# Altium schematic sheet STM32L476_MCU.SchDoc
size A
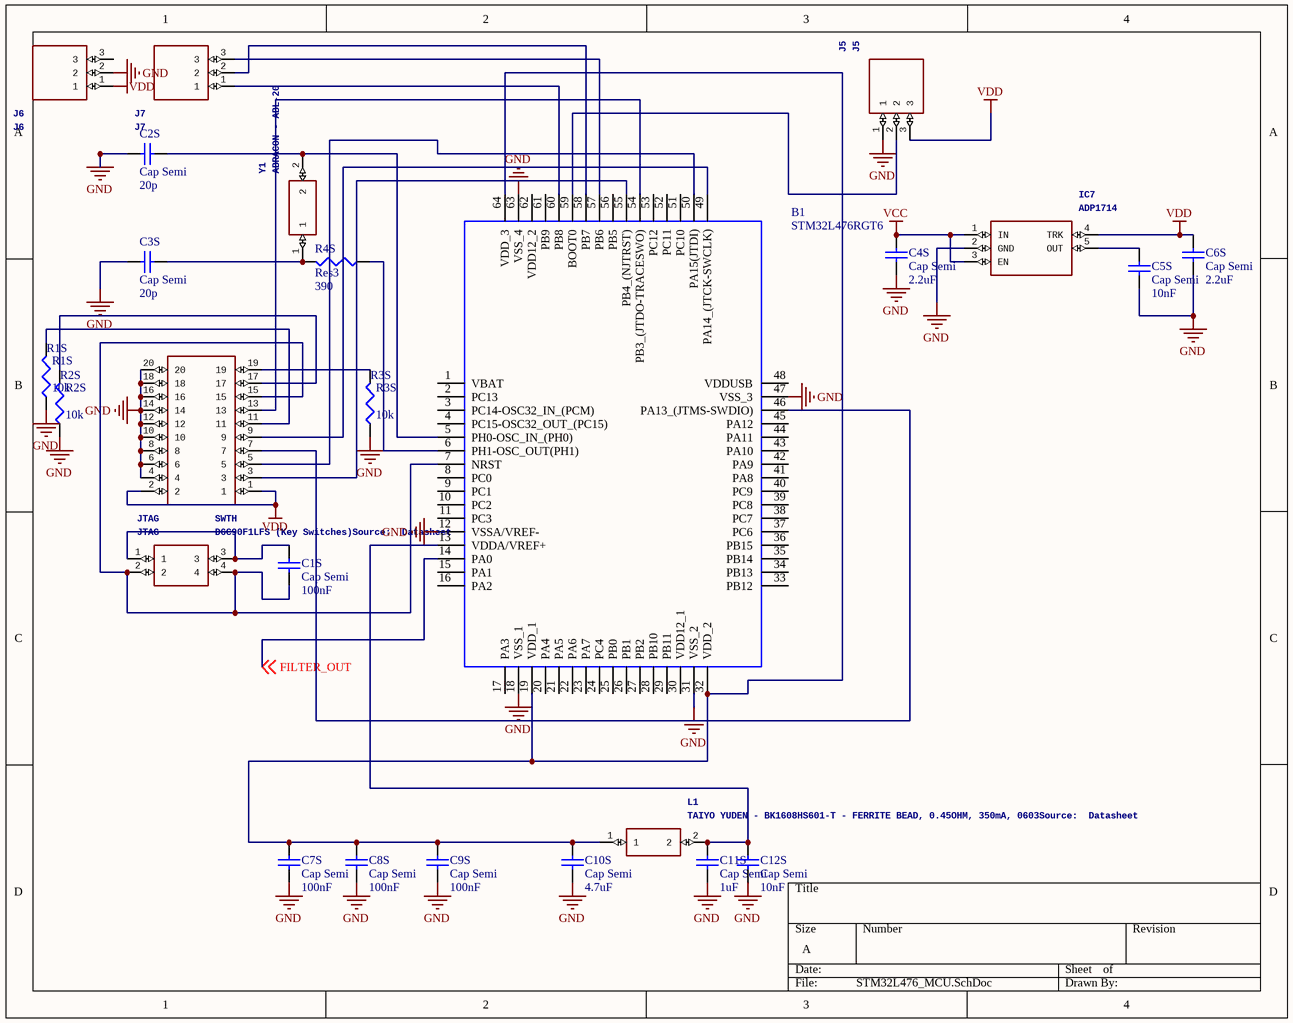
[diagram p0: STM32L476_MCU.SchDoc]

## Parts
B1  STM32L476RGT6  [QFP50P1200X1200X160-64N]
C1S  Cap Semi  value 100nF  [1608[0603]]
C2S  Cap Semi  value 20p  [1608[0603]]
C3S  Cap Semi  value 20p  [1608[0603]]
C4S  Cap Semi  value 2.2uF  [1608[0603]]
C5S  Cap Semi  value 10nF  [1608[0603]]
C6S  Cap Semi  value 2.2uF  [1608[0603]]
C7S  Cap Semi  value 100nF  [1608[0603]]
C8S  Cap Semi  value 100nF  [1608[0603]]
C9S  Cap Semi  value 100nF  [1608[0603]]
C10S  Cap Semi  value 4.7uF  [1608[0603]]
C11S  Cap Semi  value 1uF  [1608[0603]]
C12S  Cap Semi  value 10nF  [1608[0603]]
IC7  ADP1714  [SOT95P280X100-5N]
J5  J5  [HDRV3W95P0X254_1X3_762X254X869]
J6  J6  [HDRV3W95P0X254_1X3_762X254X869]
J7  J7  [HDRV3W95P0X254_1X3_762X254X869]
JTAG  JTAG  [SAMTEC_SSW-110-01-G]
L1  TAIYO YUDEN - BK1608HS601-T - FERRITE BEAD, 0.45OHM, 350mA, 0603Source:  Datasheet  [BEADC1608X95N]
R1S  R1S  value 10k  [1608[0603]]
R2S  R2S  value 10k  [1608[0603]]
R3S  R3S  value 10k  [1608[0603]]
R4S  Res3  value 390  [1608[0603]]
SWTH  D6C90F1LFS (Key Switches)Source:  Datasheet  [D6C10F1LFS]
Y1  ABRACON - ABL-20  [HC/49US_(AT49)PTH]

## Nets
GND: B1.12(VSSA/VREF-) B1.18(VSS_1) B1.31(VSS_2) B1.47(VSS_3) B1.63(VSS_4) C2S.1 C3S.1 C4S.1 C5S.1 C6S.1 C7S.1 C8S.1 C9S.1 C10S.1 C11S.1 C12S.1 IC7.2(GND) J5.1 J6.2 JTAG.4 JTAG.6 JTAG.8 JTAG.10 JTAG.12 JTAG.14 JTAG.16 JTAG.18 JTAG.20 R1S.2 R2S.2 R3S.2
VCC: C4S.2 IC7.1(IN) IC7.3(EN)
VDD: C6S.2 IC7.4(TRK) J5.3 J6.1 JTAG.1 JTAG.2
FILTER_OUT: B1.14(PA0) ; off-sheet FILTER_OUT
NetB1_5: B1.5(PH0-OSC_IN_(PH0)) C2S.2 Y1.2
NetB1_6: B1.6(PH1-OSC_OUT(PH1)) R4S.2
NetB1_7: B1.7(NRST) C1S.2 JTAG.15 SWTH.2 SWTH.4
NetB1_13: B1.13(VDDA/VREF+) C11S.2 C12S.2 L1.2
NetB1_19: B1.19(VDD_1) B1.32(VDD_2) B1.64(VDD_3) C7S.2 C8S.2 C9S.2 C10S.2 L1.1
NetB1_46: B1.46(PA13_(JTMS-SWDIO)) JTAG.7
NetB1_49: B1.49(PA14_(JTCK-SWCLK)) JTAG.9
NetB1_50: B1.50(PA15(JTDI)) JTAG.5
NetB1_54: B1.54(PB3_(JTDO-TRACESWO)) JTAG.13
NetB1_55: B1.55(PB4_(NJTRST)) JTAG.3
NetB1_57: B1.57(PB6) J7.3
NetB1_58: B1.58(PB7) J7.2
NetB1_59: B1.59(BOOT0) J5.2
NetB1_60: B1.60(PB8) J7.1
NetC1S_1: C1S.1 SWTH.1 SWTH.3
NetC3S_2: C3S.2 R4S.1 Y1.1
NetC5S_2: C5S.2 IC7.5(OUT)
NetJTAG_11: JTAG.11 R1S.1
NetJTAG_17: JTAG.17 R2S.1
NetJTAG_19: JTAG.19 R3S.1

Not connected (* = marked no-connect by the designer): B1 1(VBAT) 2(PC13) 3(PC14-OSC32_IN_(PCM)) 4(PC15-OSC32_OUT_(PC15)) 8(PC0) 9(PC1) 10(PC2) 11(PC3) 15(PA1) 16(PA2) 17(PA3) 20(PA4) 21(PA5) 22(PA6) 23(PA7) 24(PC4) 25(PB0) 26(PB1) 27(PB2) 28(PB10) 29(PB11) 30(VDD12_1) 33(PB12) 34(PB13) 35(PB14) 36(PB15) 37(PC6) 38(PC7) 39(PC8) 40(PC9) 41(PA8) 42(PA9) 43(PA10) 44(PA11) 45(PA12) 48(VDDUSB) 51(PC10) 52(PC11) 53(PC12) 56(PB5) 61(PB9) 62(VDD12_2); J6 3

## Library data of the parts
B1 = STM32L476RGT6: ARM MCU 32-bit 80MHz 1024KB  LQFP64 STMicroelectronics STM32L476RGT6, 32bit ARM Cortex M4 MCU, 80MHz, 1 MB Flash, 64-Pin LQFP; Geometry.Height: 1.6mm; Manufacturer_Name: STMicroelectronics; Manufacturer_Part_Number: STM32L476RGT6; RS Part Number: 1658235; RS Price/Stock: http://uk.rs-online.com/web/p/products/1658235; Arrow Part Number: STM32L476RGT6; Arrow Price/Stock: https://www.arrow.com/en/products/stm32l476rgt6/stmicroelectronics; Datasheet Link: https://componentsearchengine.com/Datasheets/1/STM32L476RGT6.pdf
C1S C2S C3S C4S C5S C6S C7S C8S C9S C10S C11S C12S = Cap Semi: Capacitor (Semiconductor SIM Model); Published: 8-Jun-2000; LatestRevisionDate: 29-May-2009; LatestRevisionNote: IPC-7351 Footprint Added.; PackageReference: C1206; Publisher: Altium Limited; PackageDescription: Chip Capacitor
IC7 = ADP1714AUJZ-3.3-R7: Manufacturer_Name: Analog Devices; GateName_1: G$1; SymbolName_1: ADP1714AUJZ-3.3-R7; LibraryName: ADP1714AUJZ-3.3-R7; DeviceSetName: ADP1714AUJZ-3.3-R7; Package: SOT95P280X100-5N; Manufacturer_Part_Number: ADP1714AUJZ-3.3-R7; Arrow_Part_Number: ADP1714AUJZ-3.3-R7; Height: mm
J5-J7 = 61300311121: Manufacturer_Name: Wurth Elektronik; GateName_1: G$1; SymbolName_1: 61300311121; LibraryName: 61300311121; DeviceSetName: 61300311121; Package: HDRV3W95P0X254_1X3_762X254X869; Manufacturer_Part_Number: 61300311121; RS_Part_Number: 1725145; RS_Price-Stock: http://uk.rs-online.com/web/p/products/1725145; Arrow_Part_Number: 61300311121; Arrow_Price-Stock: http://uk.rs-online.com/web/p/products/1725145; Height: 8.69mm
JTAG = SSW-110-01-G-D: Manufacturer_Name: SAMTEC; GateName_1: G$1; SymbolName_1: SSW-110-01-G-D; LibraryName: SSW-110-01-G-D; DeviceSetName: SSW-110-01-G-D; Package: SAMTEC_SSW-110-01-G; Manufacturer_Part_Number: SSW-110-01-G-D; RS_Part_Number: 7655727P; RS_Price-Stock: http://uk.rs-online.com/web/p/products/7655727P; Arrow_Part_Number: SSW-110-01-G-D; Arrow_Price-Stock: https://www.arrow.com/en/products/ssw-110-01-g-d/samtec; Height: mm
L1 = BK1608HS601-T: GateName_1: G$1; SymbolName_1: BK1608HS601-T; LibraryName: BK1608HS601-T; DeviceSetName: BK1608HS601-T; Package: BEADC1608X95N; Manufacturer_Name: TAIYO YUDEN; Manufacturer_Part_Number: BK1608HS601-T; Arrow_Part_Number: BK1608HS601-T; Height: 0.95mm
R1S R2S R3S R4S = Res3: Resistor; Published: 8-Jun-2000; LatestRevisionDate: 29-May-2009; LatestRevisionNote: IPC-7351 Footprint Added.; PackageReference: J1-0603; Publisher: Altium Limited; PackageDescription: Chip Resistor
SWTH = D6C90F1LFS: Manufacturer_Name: C & K COMPONENTS; GateName_1: G$1; SymbolName_1: D6C90F1LFS; LibraryName: D6C90F1LFS; DeviceSetName: D6C90F1LFS; Package: D6C10F1LFS; Manufacturer_Part_Number: D6C90F1LFS; Arrow_Part_Number: D6C90F1LFS; Arrow_Price-Stock: https://www.arrow.com/en/products/d6c90f1lfs/ck; Height: mm
Y1 = ABL-20.000MHZ-B2: GateName_1: G$1; SymbolName_1: ABL-20.000MHZ-B2; LibraryName: ABL-20.000MHZ-B2; DeviceSetName: ABL-20.000MHZ-B2; Package: HC/49US_(AT49)PTH; Manufacturer_Name: ABRACON; Manufacturer_Part_Number: ABL-20.000MHZ-B2; RS_Part_Number: 1710202; RS_Price-Stock: http://uk.rs-online.com/web/p/products/1710202; Arrow_Part_Number: ABL-20.000MHZ-B2; Arrow_Price-Stock: https://www.arrow.com/en/products/abl-20.000mhz-b2/abracon; Height: mm